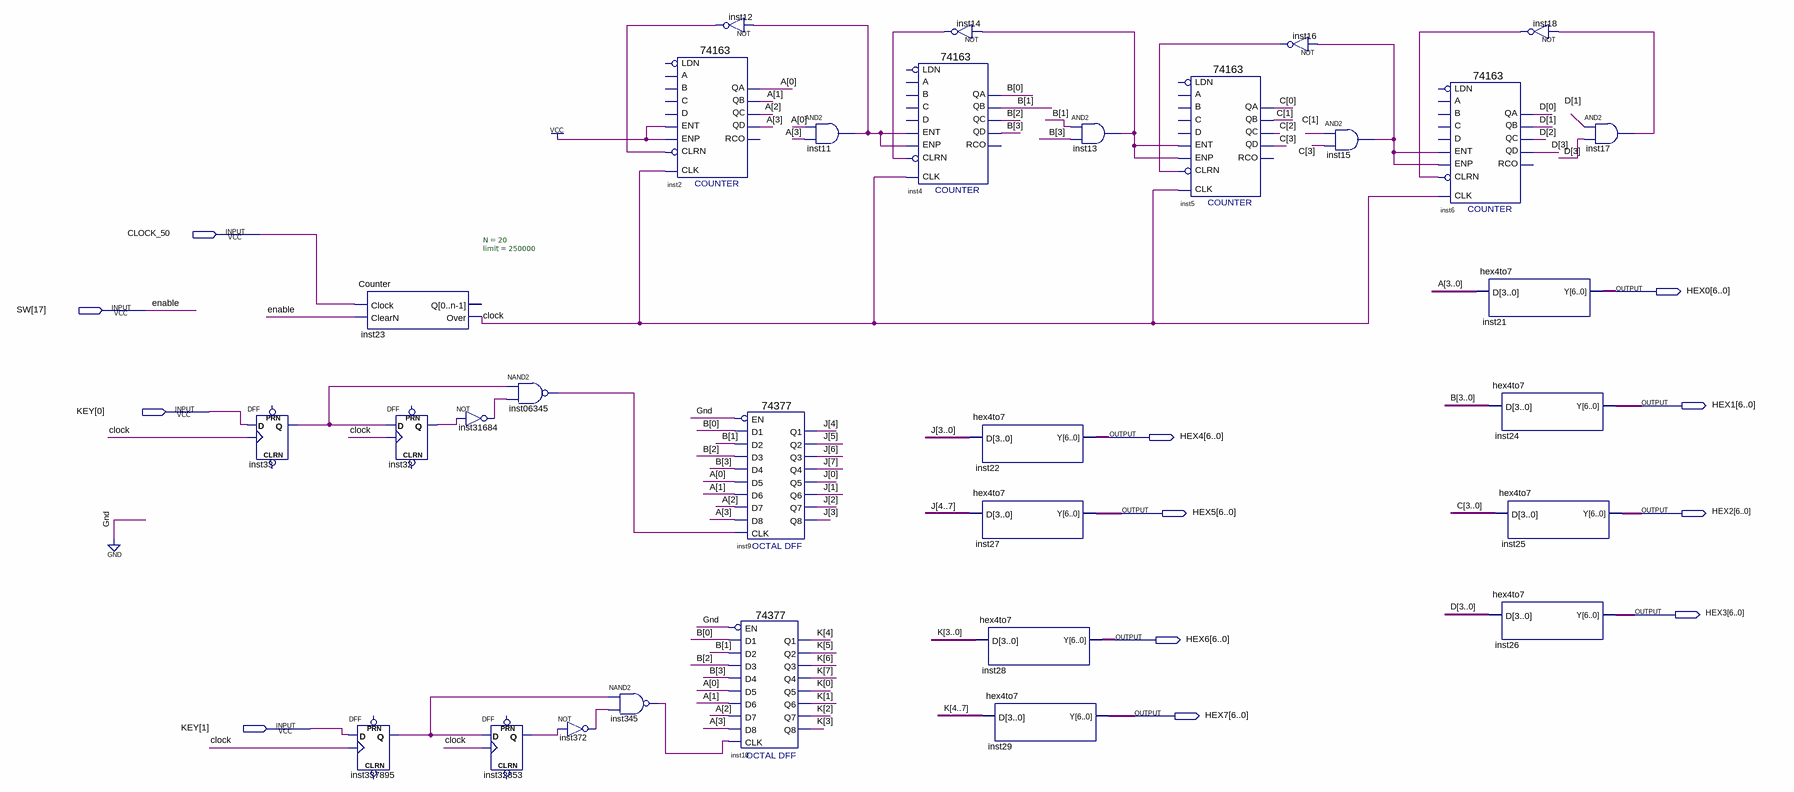
[diagram p0: schematic sheet]
// Quartus schematic lab9attp2.bdf as structural Verilog: 31 symbols, 12 pins
module lab9attp2 (
  input  CLOCK_50,
  input  [17:17] SW,
  input  [1:0] KEY,
  output [6:0] HEX0,
  output [6:0] HEX1,
  output [6:0] HEX4,
  output [6:0] HEX5,
  output [6:0] HEX2,
  output [6:0] HEX3,
  output [6:0] HEX6,
  output [6:0] HEX7
);

  wire clock, inst11_out, inst12_out, inst13_out, inst14_out, inst15_out, inst16_out, inst17_out, inst18_out,
       inst32_q, inst33_q, inst345_out, inst372_out, inst06345_out, inst31684_out, inst32853_q, inst337895_q;
  wire [3:0] A, B, C, D;
  wire [7:0] J, K;

  DFF inst33 (.CLK(clock), .D(KEY[0]), .Q(inst33_q));  // open: CLRN, PRN
  Counter #(.N(20), .limit(250000)) inst23 (.Clock(CLOCK_50), .ClearN(SW[17]), .Over(clock));  // open: Q
  DFF inst337895 (.CLK(clock), .D(KEY[1]), .Q(inst337895_q));  // open: CLRN, PRN
  DFF inst32 (.CLK(clock), .D(inst33_q), .Q(inst32_q));  // open: CLRN, PRN
  not inst31684 (inst31684_out, inst32_q);
  DFF inst32853 (.CLK(clock), .D(inst337895_q), .Q(inst32853_q));  // open: CLRN, PRN
  nand inst06345 (inst06345_out, inst33_q, inst31684_out);
  not inst372 (inst372_out, inst32853_q);
  nand inst345 (inst345_out, inst337895_q, inst372_out);
  \74163  inst2 (
    .ENT(1'b1), .CLRN(inst12_out), .CLK(clock), .ENP(1'b1), .QA(A[0]), .QB(A[1]), .QC(A[2]), .QD(A[3]));  // open: C, B, A, D, LDN, RCO
  not inst12 (inst12_out, inst11_out);
  \74377  inst9 (
    .D8(A[3]), .D7(A[2]), .CLK(inst06345_out), .D2(B[1]), .EN(1'b0), .D1(B[0]), .D6(A[1]), .D3(B[2]),
    .D4(B[3]), .D5(A[0]), .Q8(J[3]), .Q7(J[2]), .Q6(J[1]), .Q5(J[0]), .Q4(J[7]), .Q3(J[6]), .Q1(J[4]),
    .Q2(J[5]));
  \74377  inst10 (
    .D8(A[3]), .D7(A[2]), .CLK(inst345_out), .D2(B[1]), .EN(1'b0), .D1(B[0]), .D6(A[1]), .D3(B[2]),
    .D4(B[3]), .D5(A[0]), .Q8(K[3]), .Q7(K[2]), .Q6(K[1]), .Q5(K[0]), .Q4(K[7]), .Q3(K[6]), .Q1(K[4]),
    .Q2(K[5]));
  and inst11 (inst11_out, A[0], A[3]);
  \74163  inst4 (
    .ENT(inst11_out), .CLRN(inst14_out), .CLK(clock), .ENP(inst11_out), .QA(B[0]), .QB(B[1]), .QC(B[2]),
    .QD(B[3]));  // open: C, B, A, D, LDN, RCO
  not inst14 (inst14_out, inst13_out);
  hex4to7 inst22 (.D(J[3:0]), .Y(HEX4));
  hex4to7 inst27 (.D({J[4], J[5], J[6], J[7]}), .Y(HEX5));
  hex4to7 inst28 (.D(K[3:0]), .Y(HEX6));
  hex4to7 inst29 (.D({K[4], K[5], K[6], K[7]}), .Y(HEX7));
  and inst13 (inst13_out, B[1], B[3]);
  \74163  inst5 (
    .ENT(inst13_out), .CLRN(inst16_out), .CLK(clock), .ENP(inst13_out), .QA(C[0]), .QB(C[1]), .QC(C[2]),
    .QD(C[3]));  // open: C, B, A, D, LDN, RCO
  not inst16 (inst16_out, inst15_out);
  and inst15 (inst15_out, C[1], C[3]);
  \74163  inst6 (
    .ENT(inst15_out), .CLRN(inst18_out), .CLK(clock), .ENP(inst15_out), .QA(D[0]), .QB(D[1]), .QC(D[2]),
    .QD(D[3]));  // open: C, B, A, D, LDN, RCO
  hex4to7 inst21 (.D(A), .Y(HEX0));
  hex4to7 inst24 (.D(B), .Y(HEX1));
  hex4to7 inst25 (.D(C), .Y(HEX2));
  hex4to7 inst26 (.D(D), .Y(HEX3));
  not inst18 (inst18_out, inst17_out);
  and inst17 (inst17_out, D[1], D[3]);

  // Other names for the same wires on the sheet: enable = SW[17]
endmodule
